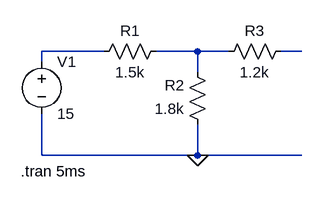
[diagram p0: schematic Draft5.asc]
Draft5.asc, the LTspice schematic file:
Version 4
SHEET 1 880 680
WIRE 80 112 -16 112
WIRE 224 112 160 112
WIRE 272 112 224 112
WIRE 384 112 352 112
WIRE -16 128 -16 112
WIRE 224 144 224 112
WIRE -16 272 -16 208
WIRE 224 272 224 224
WIRE 224 272 -16 272
WIRE 384 272 224 272
FLAG 224 272 0
SYMBOL voltage -16 112 R0
WINDOW 123 0 0 Left 0
WINDOW 39 0 0 Left 0
SYMATTR InstName V1
SYMATTR Value 15
SYMBOL res 176 96 R90
WINDOW 0 0 56 VBottom 2
WINDOW 3 32 56 VTop 2
SYMATTR InstName R1
SYMATTR Value 1.5k
SYMBOL res 240 240 R180
WINDOW 0 36 76 Left 2
WINDOW 3 36 40 Left 2
SYMATTR InstName R2
SYMATTR Value 1.8k
SYMBOL res 256 128 R270
WINDOW 0 32 56 VTop 2
WINDOW 3 0 56 VBottom 2
SYMATTR InstName R3
SYMATTR Value 1.2k
TEXT -48 296 Left 2 !.tran 5ms

The netlist it stands for:
* Draft5.asc
V1 N001 0 15
R1 N002 N001 1.5k
R2 0 N002 1.8k
R3 N002 N003 1.2k
.tran 5ms
.backanno
.end